# Altium schematic sheet BatteryManagementSystemA.SchDoc
size A4; SheetNumber: 7; SheetTotal: 13
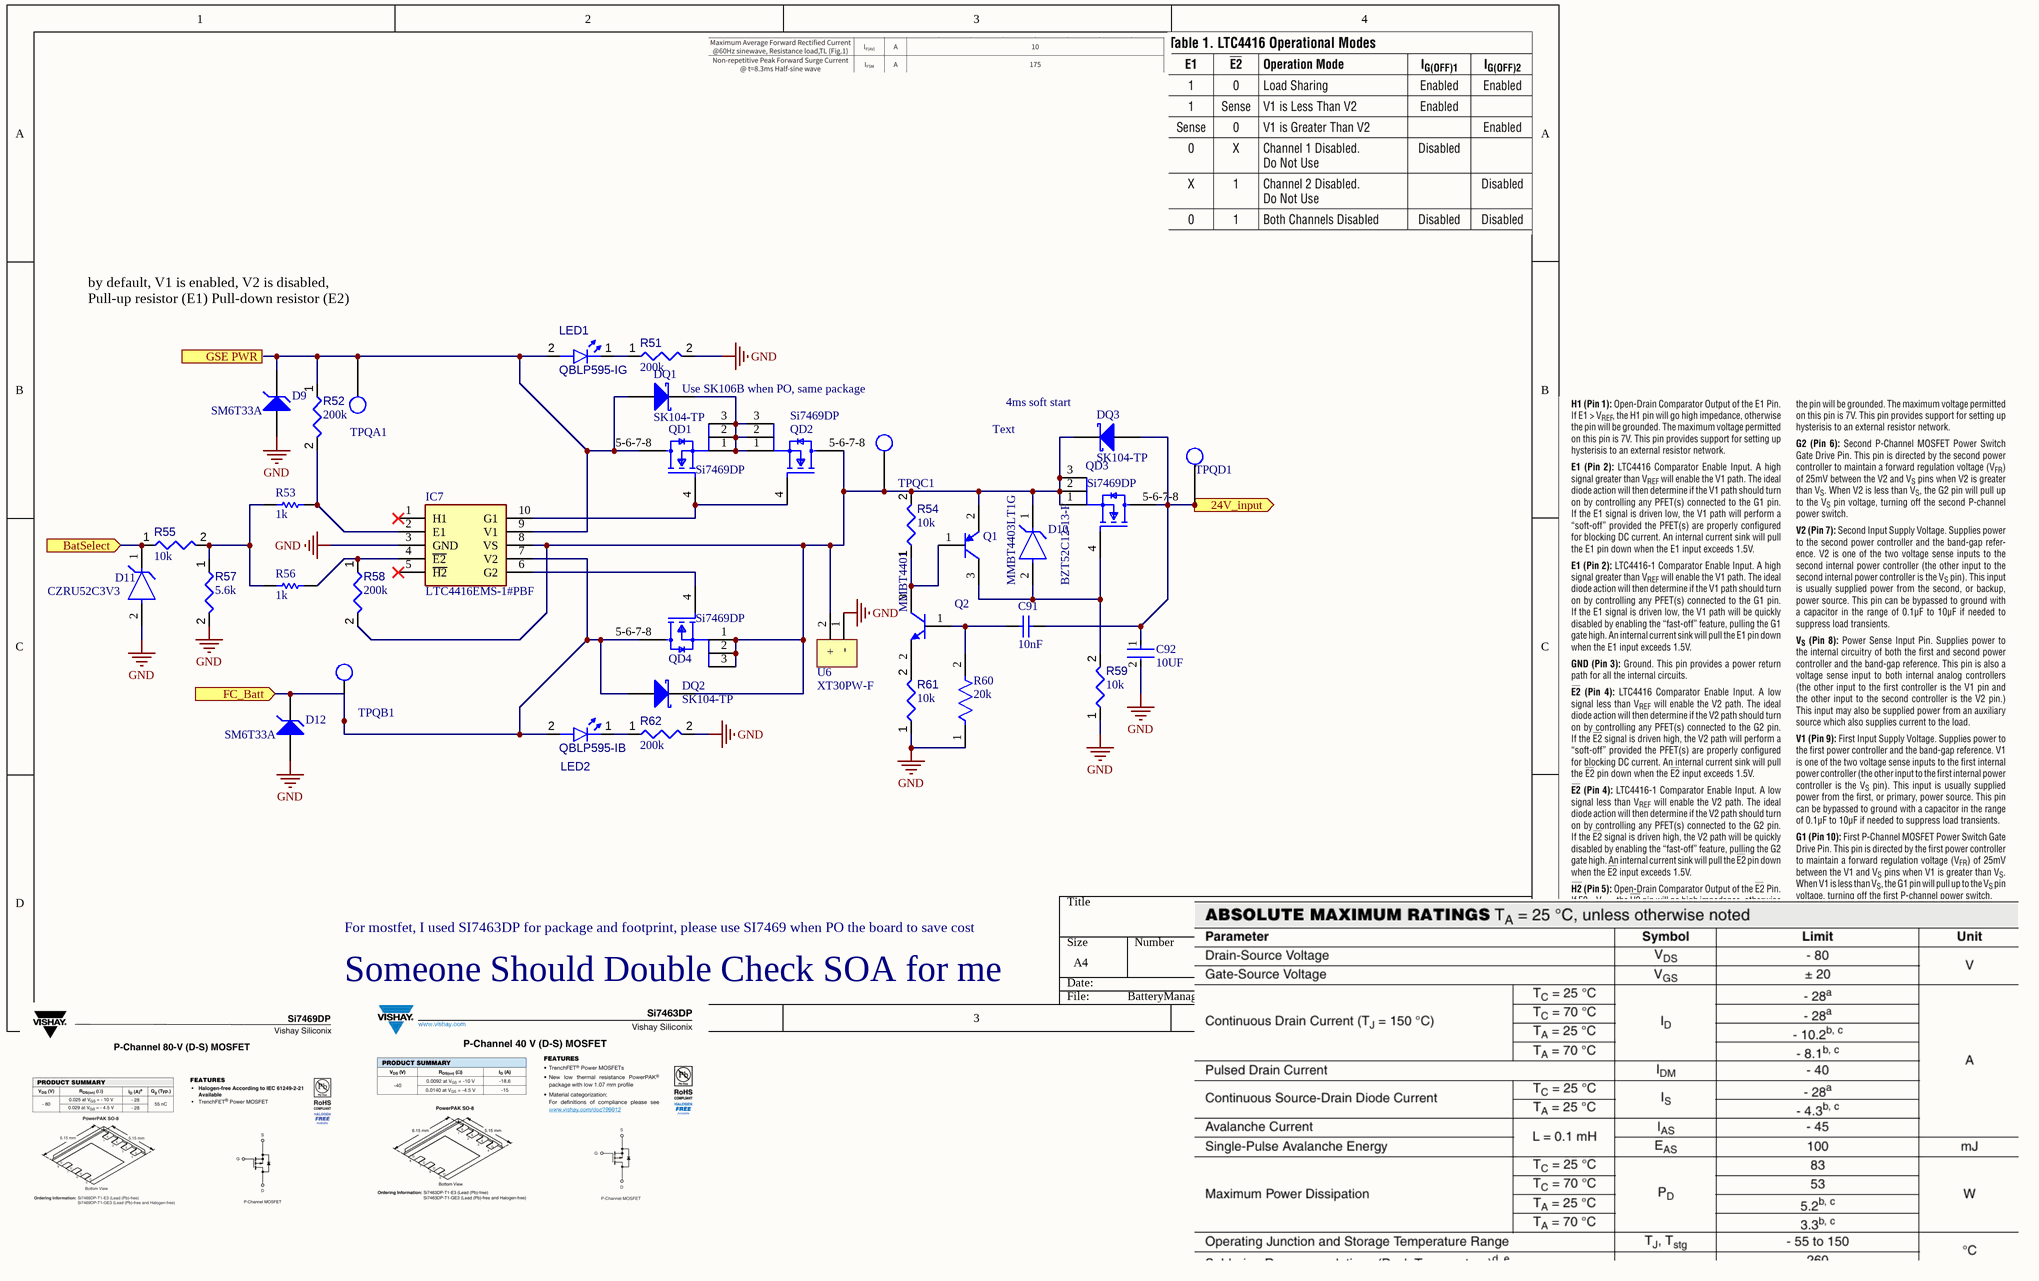
[diagram p0: BatteryManagementSystemA.SchDoc]

## Parts
C91  10nF  [CAPC1608X90X35ML10T15]
C92  10UF  [FP-GRM31-0_2-MFG]
D9  SM6T33A  [STM-SMB_P_V]
D10  BZT52C12-13-F  [FP-SOD123-MFG]
D11  CZRU52C3V3  [FP-0603-SOD-523F-MFG]
D12  SM6T33A  [STM-SMB_P_V]
DQ1  SK104-TP  [MCC-DO-214AB-2_V]
DQ2  SK104-TP  [MCC-DO-214AB-2_V]
DQ3  SK104-TP  [MCC-DO-214AB-2_V]
IC7  LTC4416EMS-1#PBF  [SOP50P490X110-10N]
LED1  QBLP595-IG  [QTB-QBLP595_V]
LED2  QBLP595-IB  [QTB-QBLP595_V]
Q1  MMBT4403LT1G  [ONSC-SOT-23-3-318-08_V]
Q2  MMBT4401  [FAIR-SOT23-3_V]
QD1  Si7469DP  [FP-S17-0173-SINGLE-MFG]
QD2  Si7469DP  [FP-S17-0173-SINGLE-MFG]
QD3  Si7469DP  [FP-S17-0173-SINGLE-MFG]
QD4  Si7469DP  [FP-S17-0173-SINGLE-MFG]
R51  value 200k  [RESC1608X55X25ML10T15]  (hidden comment: Resistor 100k +/-1% 0603 100 mW)
R52  value 200k  [RESC1608X55X25ML10T15]  (hidden comment: Resistor 100k +/-1% 0603 100 mW)
R53  1k  [RESC2013X60X35ML10T20]
R54  value 10k  [RESC2013X50X35ML15T15]  (hidden comment: Resistor 10k +/-1% 0805 125 mW)
R55  value 10k  [RESC1608X55X25ML10T15]  (hidden comment: Resistor 10k +/-1% 0603 100 mW)
R56  1k  [RESC2013X60X35ML10T20]
R57  value 5.6k  [RESC1608X55X25ML10T15]  (hidden comment: Resistor 10k +/-1% 0603 100 mW)
R58  value 200k  [RESC1608X55X25ML10T15]  (hidden comment: Resistor 100k +/-1% 0603 100 mW)
R59  value 10k  [RESC2013X50X35ML15T15]  (hidden comment: Resistor 10k +/-1% 0805 125 mW)
R60  20k  [FP-CRCW0805-e3-MFG]
R61  value 10k  [RESC2013X50X35ML15T15]  (hidden comment: Resistor 10k +/-1% 0805 125 mW)
R62  value 200k  [RESC1608X55X25ML10T15]  (hidden comment: Resistor 100k +/-1% 0603 100 mW)
TPQA1  BURPG_TestPoint1  [BURPG_TestPoint1]  (value not drawn)  (no BOM)
TPQB1  BURPG_TestPoint1  [BURPG_TestPoint1]  (value not drawn)  (no BOM)
TPQC1  BURPG_TestPoint1  [BURPG_TestPoint1]  (value not drawn)  (no BOM)
TPQD1  BURPG_TestPoint1  [BURPG_TestPoint1]  (value not drawn)  (no BOM)
U6  XT30PW-F  [XT30PW-F]

## Ports
24V_input (out), BatSelect (in), FC_Batt (in), GSE PWR (in)

## Nets
GND: C92.2 D9.2(A) D11.2(A) D12.2(A) IC7.3(GND) R51.2 R57.2 R59.1 R60.1 R61.1 R62.2 U6.1(-)
24V_input: C91.2 C92.1 DQ3.1(A) QD3.5-6-7-8(D) TPQD1.1 ; port 24V_input
BatSelect: D11.1(C) R55.1 ; port BatSelect
FC_Batt: D12.1(K) DQ2.1(A) IC7.7(V2) LED2.2(A) QD4.5-6-7-8(D) TPQB1.1 ; port FC_Batt
NetC91_1: C91.1 Q2.1(B) R60.2
NetD9_1: D9.1(K) DQ1.1(A) IC7.9(V1) LED1.2(A) QD1.5-6-7-8(D) R52.1 TPQA1.1
NetD10_1: D10.1(C) DQ2.2(K) DQ3.2(K) IC7.8(VS) Q1.2(E) QD2.5-6-7-8(D) QD3.1(S) QD3.2(S) QD3.3(S) QD4.1(S) QD4.2(S) QD4.3(S) R54.2 R58.2 TPQC1.1 U6.2(+)
NetD10_2: D10.2(A) Q1.3(C) QD3.4(G) R59.2
NetDQ1_2: DQ1.2(K) QD1.1(S) QD1.2(S) QD1.3(S) QD2.1(S) QD2.2(S) QD2.3(S)
NetIC7_2: IC7.2(E1) R52.2 R53.2
NetIC7_4: IC7.4(~{E2}) R56.2 R58.1
NetIC7_6: IC7.6(G2) QD4.4(G)
NetIC7_10: IC7.10(G1) QD1.4(G) QD2.4(G)
NetLED1_1: LED1.1(K) R51.1
NetLED2_1: LED2.1(K) R62.1
NetQ1_1: Q1.1(B) Q2.3(C) R54.1
NetQ2_2: Q2.2(E) R61.2
NetR53_1: R53.1 R55.2 R56.1 R57.1

Not connected (* = marked no-connect by the designer): IC7 1(H1)* 5(~{H2})*

## Notes on the sheet
- by default, V1 is enabled, V2 is disabled, Pull-up resistor (E1) Pull-down resistor (E2)
- (near DQ1) Use SK106B when PO, same package
- Text
- (near DQ3) 4ms soft start
- Someone Should Double Check SOA for me
- For mostfet, I used SI7463DP for package and footprint, please use SI7469 when PO the board to save cost

## Library data of the parts
C91 = CMP-2100-03642-1: Chip Capacitor, 10 nF, +/- 10%, 50 V, -55 to 125 degC, 0603 (1608 Metric), RoHS, Tape and Reel; Manufacturer: Murata; Insulation Resistance: 10GR; Dielectric: X7R; Voltage Rating: 50V; Material: Ceramic; Package Quantity: 1; Lead Free: LeadFree; Case/Package: 0603; Termination: SMD/SMT; REACH SVHC: Unknown; Manufacturer URL: http://www.murata.com/; Datasheet URL: http://search.murata.co.jp/Ceramy/image/img/A01X/G101/ENG/GRM188R71H103KA01-01.pdf; Mount: SurfaceMount; Datasheet Version: 42401.0; Number of Pins: 2; Length: 1.6mm; Voltage: 50V; Depth: 0.8mm; Tolerance: 10%; Min Operating Temperature: -55degC; Voltage Rating (DC): 50V; Max Operating Temperature: 125degC; Package Description: 2-Pin Surface Mount Device, Body 1.6 x 0.8 mm; RoHSCompliant: True; Case Code (Imperial): 0603; Width: 0.031inch; Case Code (Metric): 1608; Height: 0.8mm; Package Reference: 0603; Packaging: TapeandReel; Thickness: 0.035inch; Capacitance: 10nF; Dielectric Material: Ceramic
C92 = CMP-2000-05256-2: CAP CER 10UF 50V X5R 1206; Manufacturer: Murata Electronics North America; Manufacturer Part Number: GRM31CR61H106KA12L; Tolerance: 10%; Temperature Coefficient: 15%; Material: Ceramic; Height: 1.8mm; Temperature: -55°C to +85°C; Lead Free: Yes; Temperature Characteristic: X5R; ComponentLink2Description: Datasheet; Digikey Description: CAP CER 10UF 50V X5R 1206; Octopart: https://octopart.com/grm31cr61h106ka12l-murata-18903335; Device Class L2: Capacitors; Automotive: No; Value: 10uF; Temperature Range High: +85°C; Temperature Range Low: -55°C; Device Class L3: Ceramic Capacitors; Voltage Rating: 50V; Capacitance: 10uF; Device Class L1: Passive Components; Mouser Description: Multilayer Ceramic Capacitors MLCC - SMD/SMT 1206 10uF 50volt X5R +/-10%; ComponentLink2URL: https://search.murata.co.jp/Ceramy/image/img/A01X/G101/ENG/GRM31CR61H106KA12-01A.pdf; Package: GRM31-0.2; RoHS: TRUE; Category: Cap
D9 D12 = CMP-2000-07085-1: Transil(TM), Uni-Directional, 600 W, -55 to 150 degC, 2-Pin SMB , RoHS, Tape and Reel; Manufacturer: STMicroelectronics; SVHC: NoSVHC(17-Dec-2015); TVS Polarity: Unidirectional; Peak Pulse Power Dissipation: 600W; Peak Pulse Current Ippm: 68 / A; Breakdown Voltage Min: 31.4V; No. of Pins: 2Pins; Clamping Voltage Vc Max: 59V; Breakdown Voltage Max: 34.7V; Reverse Stand-Off Voltage Vrwm: 28.2V; Diode Case Style: DO-214AA; Power Dissipation Pd: 5 / W; Datasheet URL: http://www.st.com/st-web-ui/static/active/en/resource/technical/document/datasheet/CD00000725.pdf; Packaging: Tape&Reel; Mounting Technology: SurfaceMount; Package Description: 2-Pin Surface Mount Device, Body 4.325 x 3.625 mm; Package Reference: SMB_P; Manufacturer URL: http://www.st.com/; Datasheet Version: Rev. 9, 10/2010; Package URL: http://www.st.com/st-web-ui/static/active/en/resource/technical/document/datasheet/CD00279657.pdf
D10 = CMP-12792-000011-1: DIODE ZENER 12V 500MW SOD123; Manufacturer: Diodes Inc; Reverse Voltage: 8V; Max Zener Voltage: 12.7V; Max Reverse Leakage Current: 0.1uA; Max Junction Temp: +150°C; Standoff Height: 0mm; Forward Current: 10mA; Power Dissipation: 370mW; Automotive Grade: NA; Zener Impedance: 25Ω; ComponentLink2URL: https://www.diodes.com/assets/Datasheets/ds18004.pdf; Octopart: https://octopart.com/bzt52c12-13-f-diodes+inc.-326533; Manufacturer Part Number: BZT52C12-13-F; Footprint Url: https://www.diodes.com/assets/Package-Files/SOD123.pdf; Nom Zener Voltage: 12V; Package: SOD123; Device Class L3: Zener Diodes; ComponentLink2Description: Datasheet; Automotive: No; Device Class L2: Diodes; Height: 1.45mm; RoHS: TRUE; Digikey Description: DIODE ZENER 12V 500MW SOD123; Temperature: -65°C to +150°C; Mouser Description: Diode Zener Single 12V 5.39% 370mW Automotive 2-Pin SOD-123 T/R; Lead Free: Yes; Temperature Range High: +150°C; Device Class L1: Discrete Semiconductors; Temperature Range Low: -65°C; Category: Diode
D11 = CMP-20229-000003-1: DIODE ZENER 3.3V 150MW 0603; Zener Current: 5mA; Tolerance: 5%; Output Current: 500mA; Impedance: 95R; Element Configuration: Single; Max Reverse Leakage Current: 25uA; Max Operating Temperature: 125°C; Max Power Dissipation: 150mW; Power Rating: 150mW; Lead Free: Lead Free; Mount: Surface Mount; Packaging: Tape and Reel; Voltage Tolerance: 5%; Power Dissipation: 150mW; Zener Voltage: 3.3V; Min Operating Temperature: -55°C; Case/Package: SMD/SMT; Voltage Rating (DC): 3.3V; Package Quantity: 1
DQ1-DQ3 = CMP-2000-05214-1: Schottky Rectifier, 40 V, 10 A, -55 to 125 degC, 2-Pin SMD, RoHS, Tape and Reel; Manufacturer: Micro Commercial Components; Max Surge Current: 250A; Maximum Reverse Leakage Current: 1mA; Peak Reverse Voltage: 40V; Forward Continuous Current: 10A; Mounting Style: SMD/SMT; Product: SchottkyRectifiers; Manufacturer URL: http://www.mccsemi.com/; Datasheet URL: https://datasheet.ciiva.com/4718/sk102-sk1010hsmc-27683-4718371.pdf; Datasheet Version: Rev. B, 05/2012; RoHS: Details; Packaging: Reel; Package / Case: DO-214AB; Operating Temperature Range: -55Cto+125C
IC7 = LTC4416EMS-1#PBF: Integrated Circuit; Manufacturer_Name: Analog Devices; Datasheet Link: https://www.analog.com/media/en/technical-documentation/data-sheets/4416fa.pdf; Height: 1.1mm; Manufacturer_Part_Number: LTC4416EMS-1#PBF; Mouser Part Number: 584-LTC4416EMS-1#PBF; Mouser Price/Stock: https://www.mouser.co.uk/ProductDetail/Analog-Devices/LTC4416EMS-1PBF?qs=hVkxg5c3xu9mDay6QbsUoQ%3D%3D; Arrow Part Number: LTC4416EMS-1#PBF; Arrow Price/Stock: https://www.arrow.com/en/products/ltc4416ems-1pbf/analog-devices?region=nac
LED1 = CMP-007-00041-3: Chip LED 0402, Green, 0.02 A, 3.1 to 3.7 V, -40 to 80 degC, 2-Pin SMD, RoHS, Tape and Reel; Case/Package: 0402; Colour: Green; Mounting Technology: SMT; Pins: 2; RoHS Compliant: Yes
LED2 = CMP-007-00042-3: Chip LED 0402, Blue, 0.02 A, 3.1 to 3.7 V, -40 to 80 degC, 2-Pin SMD, RoHS, Tape and Reel; RoHS Compliant: Yes; Colour: Blue; Pins: 2; Case/Package: 0402; Mounting Technology: SMT
Q1 = CMP-1048-00539-1: Switching Transistor, PNP Silicon, 3-Pin SOT-23, Pb-Free, Tape and Reel; Manufacturer: On Semiconductor; fT Min (MHz): 200; IC Continuous (A): -0.6; ComponentLink1URL: http://www.onsemi.com/; ComponentLink2URL: http://www.onsemi.cn/pub_link/Collateral/MMBT4403LT1-D.PDF; PackageVersion: Rev. AP, 11/2009; ComponentLink1Description: Manufacturer URL; PackageDescription: 3-Pin Small Outline Transistor, Body 2.92 x 1.3 mm, Pitch 0.95 mm; Polarity: PNP; ComponentLink3Description: Package Specification; DatasheetVersion: Rev. 12; Mounting Technology: Surface Mount; PackageReference: SOT-23-3-318-08; ComponentLink3URL: http://www.onsemi.cn/pub_link/Collateral/318-08.PDF; Packing: Tape and Reel; PartNumber: MMBT4403LT1G; RoHS: TRUE; ComponentLink2Description: Datasheet
Q2 = CMP-2000-06730-1: NPN General-Purpose Amplifier, 0.6 A, 40 V, -55 to 150 degC, 3-Pin SOT-23, RoHS, Tape and Reel; Collector- Base Voltage VCBO: 60V; Collector- Emitter Voltage VCEO Max: 40V; DC Collector/Base Gain hfe Min: 100; Collector-Emitter Saturation Voltage: 0.75V; Maximum Power Dissipation: 350mW; Unit Weight: 0.002116oz; Configuration: Single; Emitter- Base Voltage VEBO: 6V; Brand: FairchildSemiconductor; Maximum DC Collector Current: 0.6A; Package Version: Rev. 12, 03/2016; DC Current Gain hFE Max: 300; Gain Bandwidth Product fT: 250MHz; Factory Pack Quantity: 3000; Product Category: BipolarTransistors-BJT; Packaging: Reel; Datasheet URL: https://www.fairchildsemi.com/datasheets/2N/2N4401.pdf; Transistor Polarity: NPN; Mounting Style: SMD/SMT; Manufacturer URL: https://www.fairchildsemi.com/; Package Description: 3-Pin Small Outline Transistor, Body 2.92 x 1.325 mm, Pitch 0.95 mm; Maximum Operating Temperature: +150C; Minimum Operating Temperature: -55C; Package Reference: SOT23-3; RoHS: Details; Datasheet Version: Rev. 1.1.0, 11/2014; Series: MMBT4401; Package URL: http://www.fairchildsemi.com/dwg/MA/MA03D.pdf; Package / Case: SOT-23; Mounting Technology: SurfaceMount; Manufacturer: FairchildSemiconductor
QD1 QD3 QD4 = CMP-02550-000199-1: Use Si7469DP For PCBA. MOSFET P-CH 40V 11A PPAK SO-8; Manufacturer: Vishay; Manufacturer Part Number: SI7463DP-T1-E3; Depletion Mode: False; Number Of Channels: 1; Pulse Drain Current: -60A; Typ Forward Diode Voltage: -0.8V; Drain To Source Voltage: -40V; Rthja Max: 52°C/W; Turn On Delay Time: 20ns; Continuous Drain Current: -11A; Max Junction Temp: +150°C; Gate Charge At Vgs: 121nC @ -10V; Max Forward Diode Voltage: -1.2V; Reverse Recovery Time: 45ns; Gate To Source Voltage: 20V; Threshold Vgs Min: -1V; Standoff Height: 0mm; Turn Off Delay Time: 200ns; Threshold Vgs Max: -3V; Transconductance: 50S; Drain To Source Resistance: 0.0075Ω; Power Dissipation: 1.9W; Temperature Range Low: -55°C; Lead Free: Yes; Device Class L3: MOSFETs; Automotive: No; Digikey Description: MOSFET P-CH 40V 11A PPAK SO-8; ComponentLink2Description: Datasheet; Octopart: https://octopart.com/si7463dp-t1-e3-vishay-42065245; Number Of P Channels: 1; Device Class L1: Discrete Semiconductors; ComponentLink2URL: http://www.vishay.com/docs/72440/si7463dp.pdf; Device Class L2: Transistors; RoHS: TRUE; Category: Trans; Mouser Description: MOSFET 40V 18.6A 5.4W 9.2mohm @ 10V; Package: S17-0173-SINGLE; Height: 1.17mm; Temperature Range High: +150°C; Temperature: -55°C to +150°C
QD2 = CMP-02550-000199-1: MOSFET P-CH 40V 11A PPAK SO-8; Manufacturer: Vishay; Manufacturer Part Number: SI7463DP-T1-E3; Depletion Mode: False; Number Of Channels: 1; Pulse Drain Current: -60A; Typ Forward Diode Voltage: -0.8V; Drain To Source Voltage: -40V; Rthja Max: 52°C/W; Turn On Delay Time: 20ns; Continuous Drain Current: -11A; Max Junction Temp: +150°C; Gate Charge At Vgs: 121nC @ -10V; Max Forward Diode Voltage: -1.2V; Reverse Recovery Time: 45ns; Gate To Source Voltage: 20V; Threshold Vgs Min: -1V; Standoff Height: 0mm; Turn Off Delay Time: 200ns; Threshold Vgs Max: -3V; Transconductance: 50S; Drain To Source Resistance: 0.0075Ω; Power Dissipation: 1.9W; Temperature Range Low: -55°C; Lead Free: Yes; Device Class L3: MOSFETs; Automotive: No; Digikey Description: MOSFET P-CH 40V 11A PPAK SO-8; ComponentLink2Description: Datasheet; Octopart: https://octopart.com/si7463dp-t1-e3-vishay-42065245; Number Of P Channels: 1; Device Class L1: Discrete Semiconductors; ComponentLink2URL: http://www.vishay.com/docs/72440/si7463dp.pdf; Device Class L2: Transistors; RoHS: TRUE; Category: Trans; Mouser Description: MOSFET 40V 18.6A 5.4W 9.2mohm @ 10V; Package: S17-0173-SINGLE; Height: 1.17mm; Temperature Range High: +150°C; Temperature: -55°C to +150°C
R51 R52 R58 R62 = CMP-009-00023-5: Chip Resistor, 100 KOhm, +/- 1%, 0.1 W, -55 to 155 degC, 0603 (1608 Metric); Voltage Rating: 50V; Power: 100mW; Max Operating Temperature: 155°C; RoHS Compliant: True; Tolerance: 1%; Pins: 2; Case/Package: 0603; Mounting Technology: SM; Min Operating Temperature: -55°C
R53 R56 = CMP-2100-03671-1: Chip Resistor, 1 KOhm, +/- 1%, 125 mW, -55 to 155 degC, 0805 (2012 Metric), RoHS, Tape and Reel; Manufacturer: Yageo; Temperature Coefficient: 100ppm/degreesC; Voltage Rating (DC): 150V; Max Power Dissipation: 125mW; Resistance: 1KOhm; Number of Pins: 2; Number of Terminations: 2; Datasheet URL: http://www.yageo.com/NewPortal/yageodocoutput?fileName=/pdf/R-Chip/PYu-RC_Group_51_RoHS_L_5.pdf; Length: 0.079inch; Package Description: 2-Pin Surface Mounted Device, Body 2 x 1.25 mm; Depth: 1.25mm; Height: 0.024inch; Military Standard: Not; Case/Package: 0805; Package Reference: 0805; RoHSCompliant: true; Lead Free: LeadFree; Packaging: TapeandReel; Package Quantity: 1; Datasheet Version: Rev. 5, 10/2016; Tolerance: 1%; Min Operating Temperature: -55degC; Voltage Rating: 150V; Composition: ThickFilm; Case Code (Imperial): 0805; Power Rating: 125mW; Width: 0.049inch; Case Code (Metric): 2012; Manufacturer URL: http://www.yageo.com/; Max Operating Temperature: 155degC; REACH SVHC: Unknown; Termination: SMD/SMT
R54 R59 R61 = CMP-009-00018-5: Chip Resistor, 10 KOhm, +/- 1%, 125 mW, -55 to 155 degC, 0805 (2012 Metric); Power: 125mW; Voltage Rating: 150V; Tolerance: 1%; Pins: 2; Min Operating Temperature: -55°C; Case/Package: 0805; Max Operating Temperature: 155°C; RoHS Compliant: True; Mounting Technology: SM
R55 R57 = CMP-009-00017-5: Chip Resistor, 10 KOhm, +/- 1%, 01 W, -55 to 155 degC, 0603 (1608 Metric); Voltage Rating: 50V; Power: 100mW; RoHS Compliant: True; Min Operating Temperature: -55°C; Pins: 2; Case/Package: 0603; Mounting Technology: SM; Max Operating Temperature: 155°C; Tolerance: 1%
R60 = CMP-2001-03667-2: RES Thick Film, 20kΩ, 1%, 0.125W, 100ppm/°C, 0805; Power Rating: 125mW; Voltage Rating (DC): 150V; Resistance: 20kR; Number of Pins: 2; Termination: SMD/SMT; Number of Terminations: 2; Case Code (Metric): 2012; Depth: 1.25mm; Packaging: Tape and Reel; Case Code (Imperial): 0805; Lead Free: Lead Free; Voltage Rating: 150V; Tolerance: 1%; Max Power Dissipation: 125mW; Composition: Thick Film; Height: 0.45mm; Weight: 0.000194oz; Working Voltage: 150V; Length: 2mm; Temperature Coefficient: 100ppm/°C; Mount: Surface Mount; Min Operating Temperature: -55°C; Features: Automotive AEC-Q200; Military Standard: Not; Contact Plating: Tin; Max Operating Temperature: 155°C; Case/Package: 0805; Package Quantity: 10; Width: 1.25mm